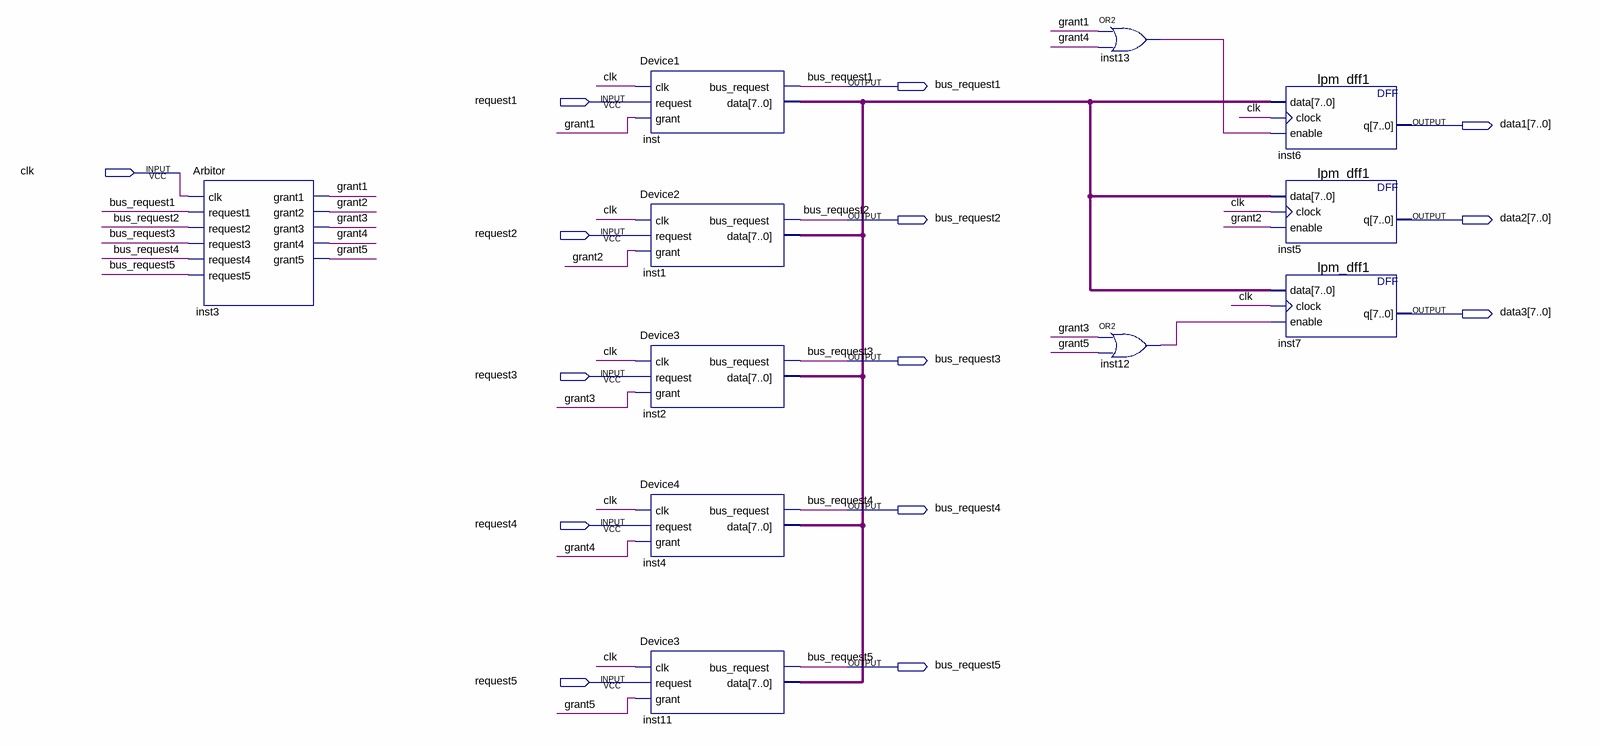
[diagram p0: schematic sheet]
// Quartus schematic MainBlock.bdf as structural Verilog: 11 symbols, 14 pins
module MainBlock (
  input  request1,
  input  clk,
  input  request2,
  input  request3,
  input  request4,
  input  request5,
  output bus_request1,
  output [7:0] data1,
  output bus_request2,
  output [7:0] data2,
  output [7:0] data3,
  output bus_request3,
  output bus_request4,
  output bus_request5
);

  wire grant1, grant2, grant3, grant4, grant5, inst12_out, inst13_out;
  wire [7:0] inst_data;

  Arbitor inst3 (
    .clk(clk), .request1(bus_request1), .request2(bus_request2), .request3(bus_request3),
    .request4(bus_request4), .request5(bus_request5), .grant1(grant1), .grant2(grant2), .grant3(grant3),
    .grant4(grant4), .grant5(grant5));
  Device1 inst (.clk(clk), .request(request1), .grant(grant1), .bus_request(bus_request1), .data(inst_data));
  Device2 inst1 (.clk(clk), .request(request2), .grant(grant2), .bus_request(bus_request2), .data(inst_data));
  Device3 inst2 (.clk(clk), .request(request3), .grant(grant3), .bus_request(bus_request3), .data(inst_data));
  Device4 inst4 (.clk(clk), .request(request4), .grant(grant4), .bus_request(bus_request4), .data(inst_data));
  Device3 inst11 (.clk(clk), .request(request5), .grant(grant5), .bus_request(bus_request5), .data(inst_data));
  or inst13 (inst13_out, grant1, grant4);
  or inst12 (inst12_out, grant3, grant5);
  lpm_dff1 inst6 (.data(inst_data), .clock(clk), .enable(inst13_out), .q(data1));
  lpm_dff1 inst5 (.data(inst_data), .clock(clk), .enable(grant2), .q(data2));
  lpm_dff1 inst7 (.data(inst_data), .clock(clk), .enable(inst12_out), .q(data3));
endmodule
